# EAGLE design sequenceGameRev1-0 (EAGLE 9.6.2)
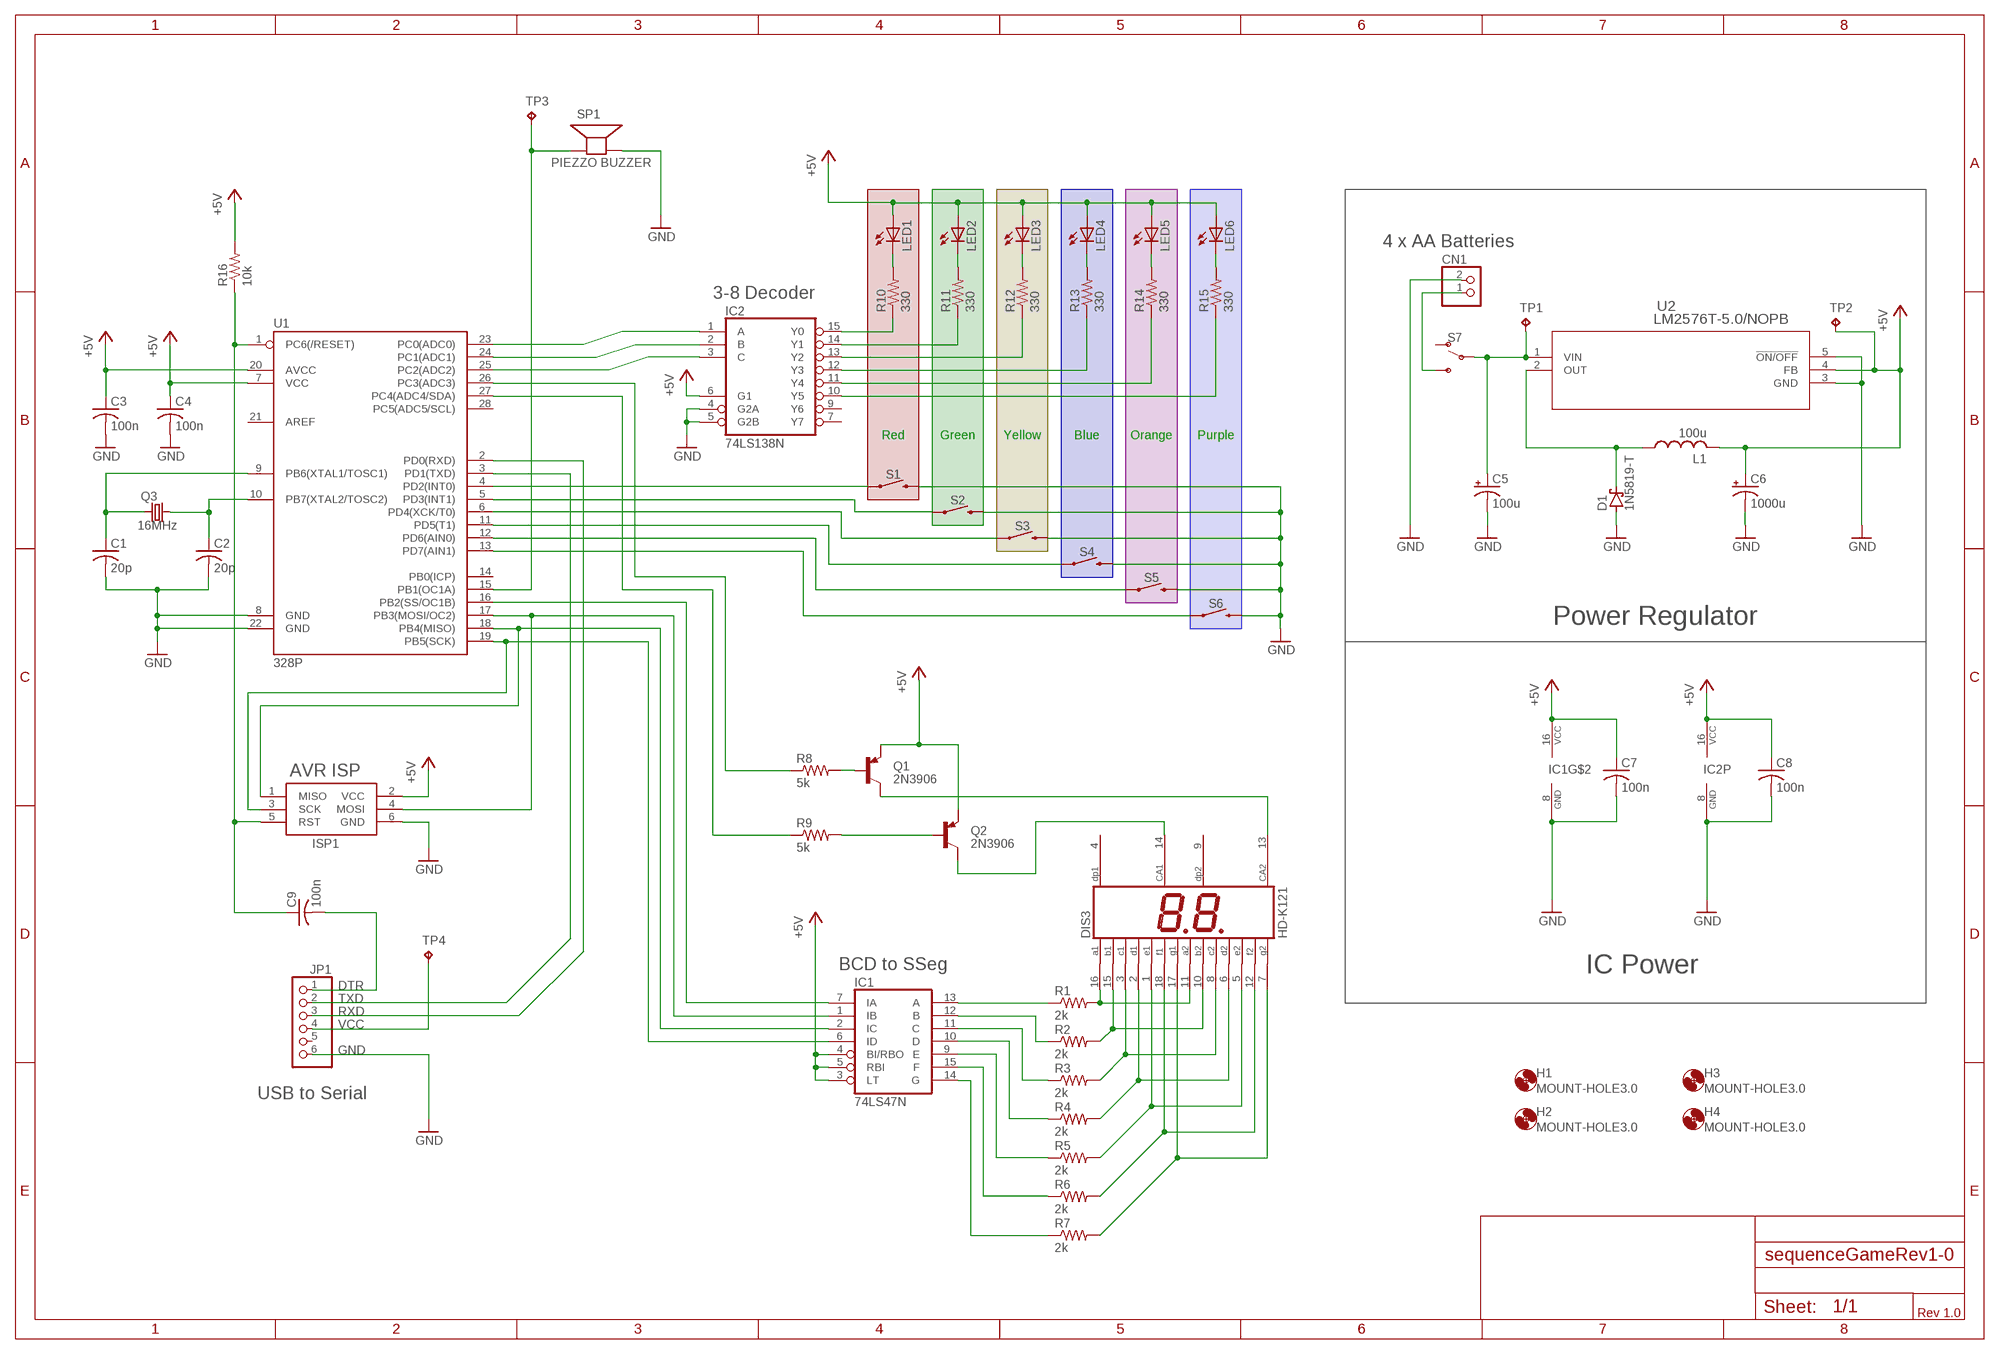
[diagram p0: schematic, sheet 1]

## Parts
C1  20p  C-US050-025X075  [C050-025X075]
C2  20p  C-US050-025X075  [C050-025X075]
C3  100n  C-US050-025X075  [C050-025X075]
C4  100n  C-US050-025X075  [C050-025X075]
C5  100u  CPOL-USE2.5-5  [E2,5-5]
C6  1000u  CPOL-USE5-10.5  [E5-10,5]
C7  100n  C-US050-025X075  [C050-025X075]
C8  100n  C-US050-025X075  [C050-025X075]
C9  100n  C-US050-025X075  [C050-025X075]
CN1  JST_2PIN-THM  [JST-PH-2-THM]
D1  1N5819-T  [DO41-7.6]
DIS3  HD-K121  [HDSP-R]
H1  MOUNT-HOLE3.0  [3,0]
H2  MOUNT-HOLE3.0  [3,0]
H3  MOUNT-HOLE3.0  [3,0]
H4  MOUNT-HOLE3.0  [3,0]
IC1  74LS47N  [DIL16]
IC2  74LS138N  [DIL16]
ISP1  AVRISP-6  [AVRISP]
JP1  PINHD-1X6  [1X06]
L1  100u  L-US0207/10  [0207/10]
LED1  LED5MM  [LED5MM]
LED2  LED5MM  [LED5MM]
LED3  LED5MM  [LED5MM]
LED4  LED5MM  [LED5MM]
LED5  LED5MM  [LED5MM]
LED6  LED5MM  [LED5MM]
Q1  2N3906  [TO92]
Q2  2N3906  [TO92]
Q3  16MHz  CRYSTALHC49S  [HC49/S]
R1  2k  R-US_0207/10  [0207/10]
R2  2k  R-US_0207/10  [0207/10]
R3  2k  R-US_0207/10  [0207/10]
R4  2k  R-US_0207/10  [0207/10]
R5  2k  R-US_0207/10  [0207/10]
R6  2k  R-US_0207/10  [0207/10]
R7  2k  R-US_0207/10  [0207/10]
R8  5k  R-US_0207/10  [0207/10]
R9  5k  R-US_0207/10  [0207/10]
R10  330  R-US_0207/10  [0207/10]
R11  330  R-US_0207/10  [0207/10]
R12  330  R-US_0207/10  [0207/10]
R13  330  R-US_0207/10  [0207/10]
R14  330  R-US_0207/10  [0207/10]
R15  330  R-US_0207/10  [0207/10]
R16  10k  R-US_0207/10  [0207/10]
S1  MOMENTARY-SWITCH-SPST-PTH-6.0MM  [TACTILE_SWITCH_PTH_6.0MM]
S2  MOMENTARY-SWITCH-SPST-PTH-6.0MM  [TACTILE_SWITCH_PTH_6.0MM]
S3  MOMENTARY-SWITCH-SPST-PTH-6.0MM  [TACTILE_SWITCH_PTH_6.0MM]
S4  MOMENTARY-SWITCH-SPST-PTH-6.0MM  [TACTILE_SWITCH_PTH_6.0MM]
S5  MOMENTARY-SWITCH-SPST-PTH-6.0MM  [TACTILE_SWITCH_PTH_6.0MM]
S6  MOMENTARY-SWITCH-SPST-PTH-6.0MM  [TACTILE_SWITCH_PTH_6.0MM]
S7  SWITCH-SPDT-PTH-11.6X4.0MM  [SWITCH_SPDT_PTH_11.6X4.0MM]
SP1  PIEZZO BUZZER  SPEAKER/AL60P  [AL60P]
TP1  TPB1,27  [B1,27]
TP2  TPB1,27  [B1,27]
TP3  TPB1,27  [B1,27]
TP4  TPB1,27  [B1,27]
U1  328P  ATMEGA328P_PDIP  [DIP28]
U2  LM2576T-5.0/NOPB  [T05A_TEX]

## Nets
+5V [POWER]: C3.1 C4.1 C6.+ C7.1 C8.1 IC1.3(LT) IC1.4(BI/RBO) IC1.5(RBI) IC1.16(VCC) IC2.6(G1) IC2.16(VCC) ISP1.2(VCC) L1.2 LED1.A LED2.A LED3.A LED4.A LED5.A LED6.A Q1.3(E) Q2.3(E) R16.2 TP2.TP U1.7(VCC) U1.20(AVCC) U2.4(FB)
BATT_IN [POWER]: CN1.1 S7.3(S)
DTR: C9.2 JP1.1
GND [GND]: C1.2 C2.2 C3.2 C4.2 C5.- C6.- C7.2 C8.2 CN1.2 D1.A IC1.8(GND) IC2.4(G2A) IC2.5(G2B) IC2.8(GND) ISP1.6(GND) JP1.6 S1.3 S2.3 S3.3 S4.3 S5.3 S6.3 SP1.2(-) U1.8(GND) U1.22(GND) U2.3(GND) U2.5(!ON/OFF)
LDO_IN [POWER]: C5.+ S7.2(P) TP1.TP U2.1(VIN)
LDO_OUT [POWER]: D1.C L1.1 U2.2(OUT)
N$1: DIS3.10(B2) DIS3.15(B1) R2.2
N$2: SP1.1(+) TP3.TP U1.15(PB1(OC1A))
N$3: DIS3.3(C1) DIS3.8(C2) R3.2
N$4: DIS3.2(D1) DIS3.6(D2) R4.2
N$5: DIS3.1(E1) DIS3.5(E2) R5.2
N$6: DIS3.12(F2) DIS3.18(F1) R6.2
N$7: IC1.13(A) R1.1
N$8: IC1.12(B) R2.1
N$9: IC1.11(C) R3.1
N$10: IC1.10(D) R4.1
N$11: IC1.9(E) R5.1
N$12: Q2.2(B) R9.2
N$13: R8.1 U1.26(PC3(ADC3))
N$14: Q1.2(B) R8.2
N$15: DIS3.7(G2) DIS3.17(G1) R7.2
N$16: C2.1 Q3.1 U1.10(PB7(XTAL2/TOSC2))
N$17: IC2.15(Y0) R10.1
N$18: IC2.14(Y1) R11.1
N$19: IC2.13(Y2) R12.1
N$20: IC2.12(Y3) R13.1
N$21: IC2.11(Y4) R14.1
N$22: IC2.10(Y5) R15.1
N$23: C1.1 Q3.2 U1.9(PB6(XTAL1/TOSC1))
N$24: LED1.K(C) R10.2
N$25: LED2.K(C) R11.2
N$26: LED3.K(C) R12.2
N$27: LED4.K(C) R13.2
N$28: LED5.K(C) R14.2
N$29: LED6.K(C) R15.2
N$30: IC1.15(F) R6.1
N$31: S4.1 U1.11(PD5(T1))
N$32: S5.1 U1.12(PD6(AIN0))
N$33: IC1.6(ID) ISP1.3(SCK) U1.19(PB5(SCK))
N$35: S6.1 U1.13(PD7(AIN1))
N$37: IC1.2(IC) ISP1.1(MISO) U1.18(PB4(MISO))
N$38: S2.1 U1.5(PD3(INT1))
N$39: IC2.1(A) U1.23(PC0(ADC0))
N$40: IC2.2(B) U1.24(PC1(ADC1))
N$41: S3.1 U1.6(PD4(XCK/T0))
N$42: IC1.7(IA) U1.16(PB2(SS/OC1B))
N$43: IC1.1(IB) ISP1.4(MOSI) U1.17(PB3(MOSI/OC2))
N$44: R9.1 U1.27(PC4(ADC4/SDA))
N$45: DIS3.13(CA2) Q1.1(C)
N$46: IC2.3(C) U1.25(PC2(ADC2))
N$47: DIS3.14(CA1) Q2.1(C)
N$48: DIS3.11(A2) DIS3.16(A1) R1.2
N$51: IC1.14(G) R7.1
N$52: S1.1 U1.4(PD2(INT0))
RESET: C9.1 ISP1.5(RST) R16.1 U1.1(PC6(/RESET))
RXD: JP1.3 U1.2(PD0(RXD))
TXD: JP1.2 U1.3(PD1(TXD))
VCC: JP1.4 TP4.TP
Unconnected: DIS3.4(DP1) DIS3.9(DP2) IC2.7(Y7) IC2.9(Y6) JP1.5 S7.1(O) U1.14(PB0(ICP)) U1.21(AREF) U1.28(PC5(ADC5/SCL))

## Notes on the sheet
- 4 x AA Batteries
- 3-8 Decoder
- Red | Green | Yellow | Blue | Orange | Purple
- Power Regulator
- AVR ISP
- BCD to SSeg | IC Power
- USB to Serial
- Rev 1.0

## Library data of the parts
C1-C4 C7-C9 = adafruit:C-US: CAPACITOR, American symbol
C5 C6 = adafruit:CPOL-US: POLARIZED CAPACITOR, American symbol
CN1 = adafruit:JST_2PIN: JST 2-Pin Connectors of various flavors SMT-RA (S2B-PH-SM4) 4UConnector #17311 SMT (B2B-PH-SM4) THM-RA (S2B-PH) THM (B2B-PH)
D1 = diode:1N581*: 1.0A SCHOTTKY BARRIER RECTIFIER Source: http://www.diodes.com/datasheets/ds23001.pdf
DIS3 = display-hp:HD-K121: LED DISPLAY 2 x 1 character 7 segment, decimal points right; OC_FARNELL: unknown; OC_NEWARK: unknown
H1-H4 = holes:MOUNT-HOLE: MOUNTING HOLE with drill center marker
IC1 = 74xx-us:74*47: BCD to seven segment DECODER/DRIVER Source: http://www.ee.washington.edu/stores/DataSheets/74ls/74ls47.pdf
IC2 = 74xx-us:74*138: 3-line to 8-line DECODER/DEMULTIPLEXER
ISP1 = adafruit:AVRISP: AVR ISP HEADER Standard 6 pin header for AVR programming
JP1 = adafruit:PINHD-1X6: PIN HEADER
L1 = rcl:L-US: INDUCTOR, American symbol; SPICEPREFIX: L
LED1-LED6 = adafruit:LED: LED OSRAM: - CHIPLED LG R971, LG N971, LY N971, LG Q971, LY Q971, LO R971, LY R971 LH N974, LH R974 LS Q976, LO Q976, LY Q976 LO Q996 - Hyper CHIPLED LW Q18S LB Q993, LB Q99A, LB R99A - SideLED LS A670, LO A670, LY A670, LG A670, LP A670 LB A673, LV A673, LT A673, LW A673 LH A674 LY A675 LS A676, LA A676, LO A676, LY A676, LW A676 LS A679, LY A679, LG A679 - Hyper Micro SIDELED® LS Y876, LA Y876, LO Y876, LY Y876 LT Y87S - SmartLED LW L88C, LW L88S LB L89C, LB L89S, LG L890 LS L89K, LO L89K, LY L89K LS L896, LA L896, LO L896, LY L896 - TOPLED LS T670, LO T670, LY T670, LG T670, LP T670 LSG T670, LSP T670, LSY T670, LOP T670, LYG T670 LG T671, LOG T671, LSG T671 LB T673, LV T673, LT T673, LW T673 LH T674 LS T676, LA T676, LO T676, LY T676, LB T676, LH T676, LSB T676, LW T676 LB T67C, LV T67C, LT T67C, LS T67K, LO T67K, LY T67K, LW E67C LS E67B, LA E67B, LO E67B, LY E67B, LB E67C, LV E67C, LT E67C LW T67C LS T679, LY T679, LG T679 LS T770, LO T770, LY T770, LG T770, LP T770 LB T773, LV T773, LT T773, LW T773 LH T774 LS E675, LA E675, LY E675, LS T675 LS T776, LA T776, LO T776, LY T776, LB T776 LHGB T686 LT T68C, LB T68C - Hyper Mini TOPLED® LB M676 - Mini TOPLED Santana® LG M470 LS M47K, LO M47K, LY M47K Source: http://www.osram.convergy.de/
Q1 Q2 = transistor-pnp:2N3906: PNP Transistor
Q3 = crystal:CRYSTAL: CRYSTAL; OC_FARNELL: 1667008; OC_NEWARK: unknown
R1-R16 = adafruit:R-US_: RESISTOR, American symbol
S1-S6 = SparkFun-Switches:MOMENTARY-SWITCH-SPST: Momentary Switch (Pushbutton) - SPST Normally-open (NO) SPST momentary switches (buttons, pushbuttons). Variants PTH-12MM - 12mm square, through-hole Momentary Pushbutton Switch - 12mm Square <https://www.sparkfun.com/products/9190> (COM-09190) PTH-6.0MM, PTH-6.0MM-KIT - 6.0mm square, through-hole Mini Pushbutton Switch <https://www.sparkfun.com/products/97> (COM-00097) KIT package intended for soldering kit's - only one side of pads' copper is exposed. PTH-RIGHT-ANGLE-KIT - Right-angle, through-hole Right Angle Tactile Button <https://www.sparkfun.com/products/10791> - Used on SparkFun BigTime Watch Kit <https://www.sparkfun.com/products/11734> SMD-12MM - 12mm square, surface-mount Tactile Button - SMD (12mm) <https://www.sparkfun.com/products/12993> (COM-12993) Used on SparkFun PicoBoard <https://www.sparkfun.com/products/11888> SMD-4.5MM - 4.5mm Square Trackball Switch Used on SparkFun Blackberry Trackballer Breakout <https://www.sparkfun.com/products/13169> SMD-4.6MMX2.8MM - 4.60mm x 2.80mm, surface mount Used on SparkFun SAMD21 Mini Breakout <https://www.sparkfun.com/products/13664> SMD-5.2MM, SMD-5.2-REDUNDANT - 5.2mm square, surface-mount Mini Pushbutton Switch - SMD <https://www.sparkfun.com/products/8720> (COM-08720) Used on Arduino Pro Mini <https://www.sparkfun.com/products/11114> REDUNDANT package connects both switch circuits together SMD-6.0X3.5MM - 6.0 x 3.5mm, surface mount Momentary Reset Switch SMD <https://www.sparkfun.com/products/8229> (COM-08229) SMD-6.2MM-TALL - 6.2mm square, surface mount Tactile Button - SMD (6mm) <https://www.sparkfun.com/products/12992> Used on SparkFun Digital Sandbox <https://www.sparkfun.com/products/12651> SMD-RIGHT-ANGLE - Right-angle, surface mount Used on SparkFun Block for Intel® Edison - Arduino <https://www.sparkfun.com/products/13036>; PROD_ID: SWCH-08441; SF_SKU: COM-00097
S7 = SparkFun-Switches:SWITCH-SPDT: Single Pole, Double Throw (SPDT) Switch Single-pole, double-throw (SPDT) switch. Variant Overview SMD-AYZ0202 Surface Mount DPDT Switch <https://www.sparkfun.com/products/597> (COM-00597) Used on e.g. LilyPad Arduino USB - ATmega32U4 Board <https://www.sparkfun.com/products/12049> PTH-11.6X4.0MM SPDT Mini Power Switch <https://www.sparkfun.com/products/102> (COM-00102) Used on e.g. SparkFun Simon Says - Through-Hole Soldering Kit <https://www.sparkfun.com/products/10547> (KIT-10547) PTH-11.6X4.0MM-KIT KIT version of SPDT Mini Power Switch - Simplifies soldering by removing tStop of switch pins - only one side can be soldered. PTH-11.6X4.0MM-LOCK LOCK version of SPDT Mini Power Switch - Offset pins hold switch in place for easier soldering. SMD-RIGHT-ANGLE Surface Mount Right Angle Switch <https://www.sparkfun.com/products/10860> (COM-10860) Used on e.g. SparkFun ESP8266 Thing <https://www.sparkfun.com/products/13231>; PROD_ID: SWCH-08261; SF_SKU: COM-00102
SP1 = adafruit:SPEAKER: SPEAKER Source: Buerklin Added PS12 (for part # PS1240 piezo) http://www.ladyada.net/library/pcb/eaglelibrary.html
TP1-TP4 = testpad:TP: Test pad
U1 = SparkFun-IC-Microcontroller:ATMEGA328P_PDIP: Atmel 328P Through hole ATMEGA328P uC used in the Arduino 32kb flash, 1k EEPROM, 2k SRAM Datasheet <http://www.sparkfun.com/datasheets/Components/SMD/ATMega328.pdf> SparkFun Products Storefront component: AVR 28 Pin 20MHz 32K 6A/D - ATMega328P <https://www.sparkfun.com/products/9061> (COM-09061) SparkFun Simon Says - Through-Hole Soldering Kit <https://www.sparkfun.com/products/10547> (KIT-10547) SparkFun Learn to Solder - Simon Says <https://www.sparkfun.com/products/13708> (KIT-13708) SparkFun BigTime Watch Kit <https://www.sparkfun.com/products/11734> (KIT-11734) SparkFun ClockIt <https://www.sparkfun.com/products/10930> (KIT-10930) SparkFun Serial Enabled LCD Kit <https://www.sparkfun.com/products/10097> (LCD-10097) SparkFun Simon Tilts - Through Hole Soldering Kit <https://www.sparkfun.com/products/12634> (KIT-12634) SparkFun Frequency Counter Kit <https://www.sparkfun.com/products/10140> (KIT-10140) FabFM Radio Kit <https://www.sparkfun.com/products/11043> (KIT-11043) SparkFun Binary Blaster Kit <https://www.sparkfun.com/products/12037> (KIT-12037) SparkFun Metro-Gnome <https://www.sparkfun.com/products/9236> (KIT-09236) ATmega328 with Arduino Optiboot (Uno) <https://www.sparkfun.com/products/10524> (DEV-10524); PROD_ID: IC-09136
U2 = Jons_Parts:LM2576T-5.0/NOPB; BUILT_BY: EMA_UL_Team; COPYRIGHT: Copyright (C) 2018 Accelerated Designs. All rights reserved; MANUFACTURER_PART_NUMBER: LM2576T-5.0/NOPB; SOURCELIBRARY: National_2011-09-26; VENDOR: Texas Instruments

## Net classes
0 default: width 0.5 mm, clearance 0.2 mm
1 POWER: width 1 mm, clearance 0.2 mm
2 GND: width 1 mm, clearance 0.2 mm

## Board
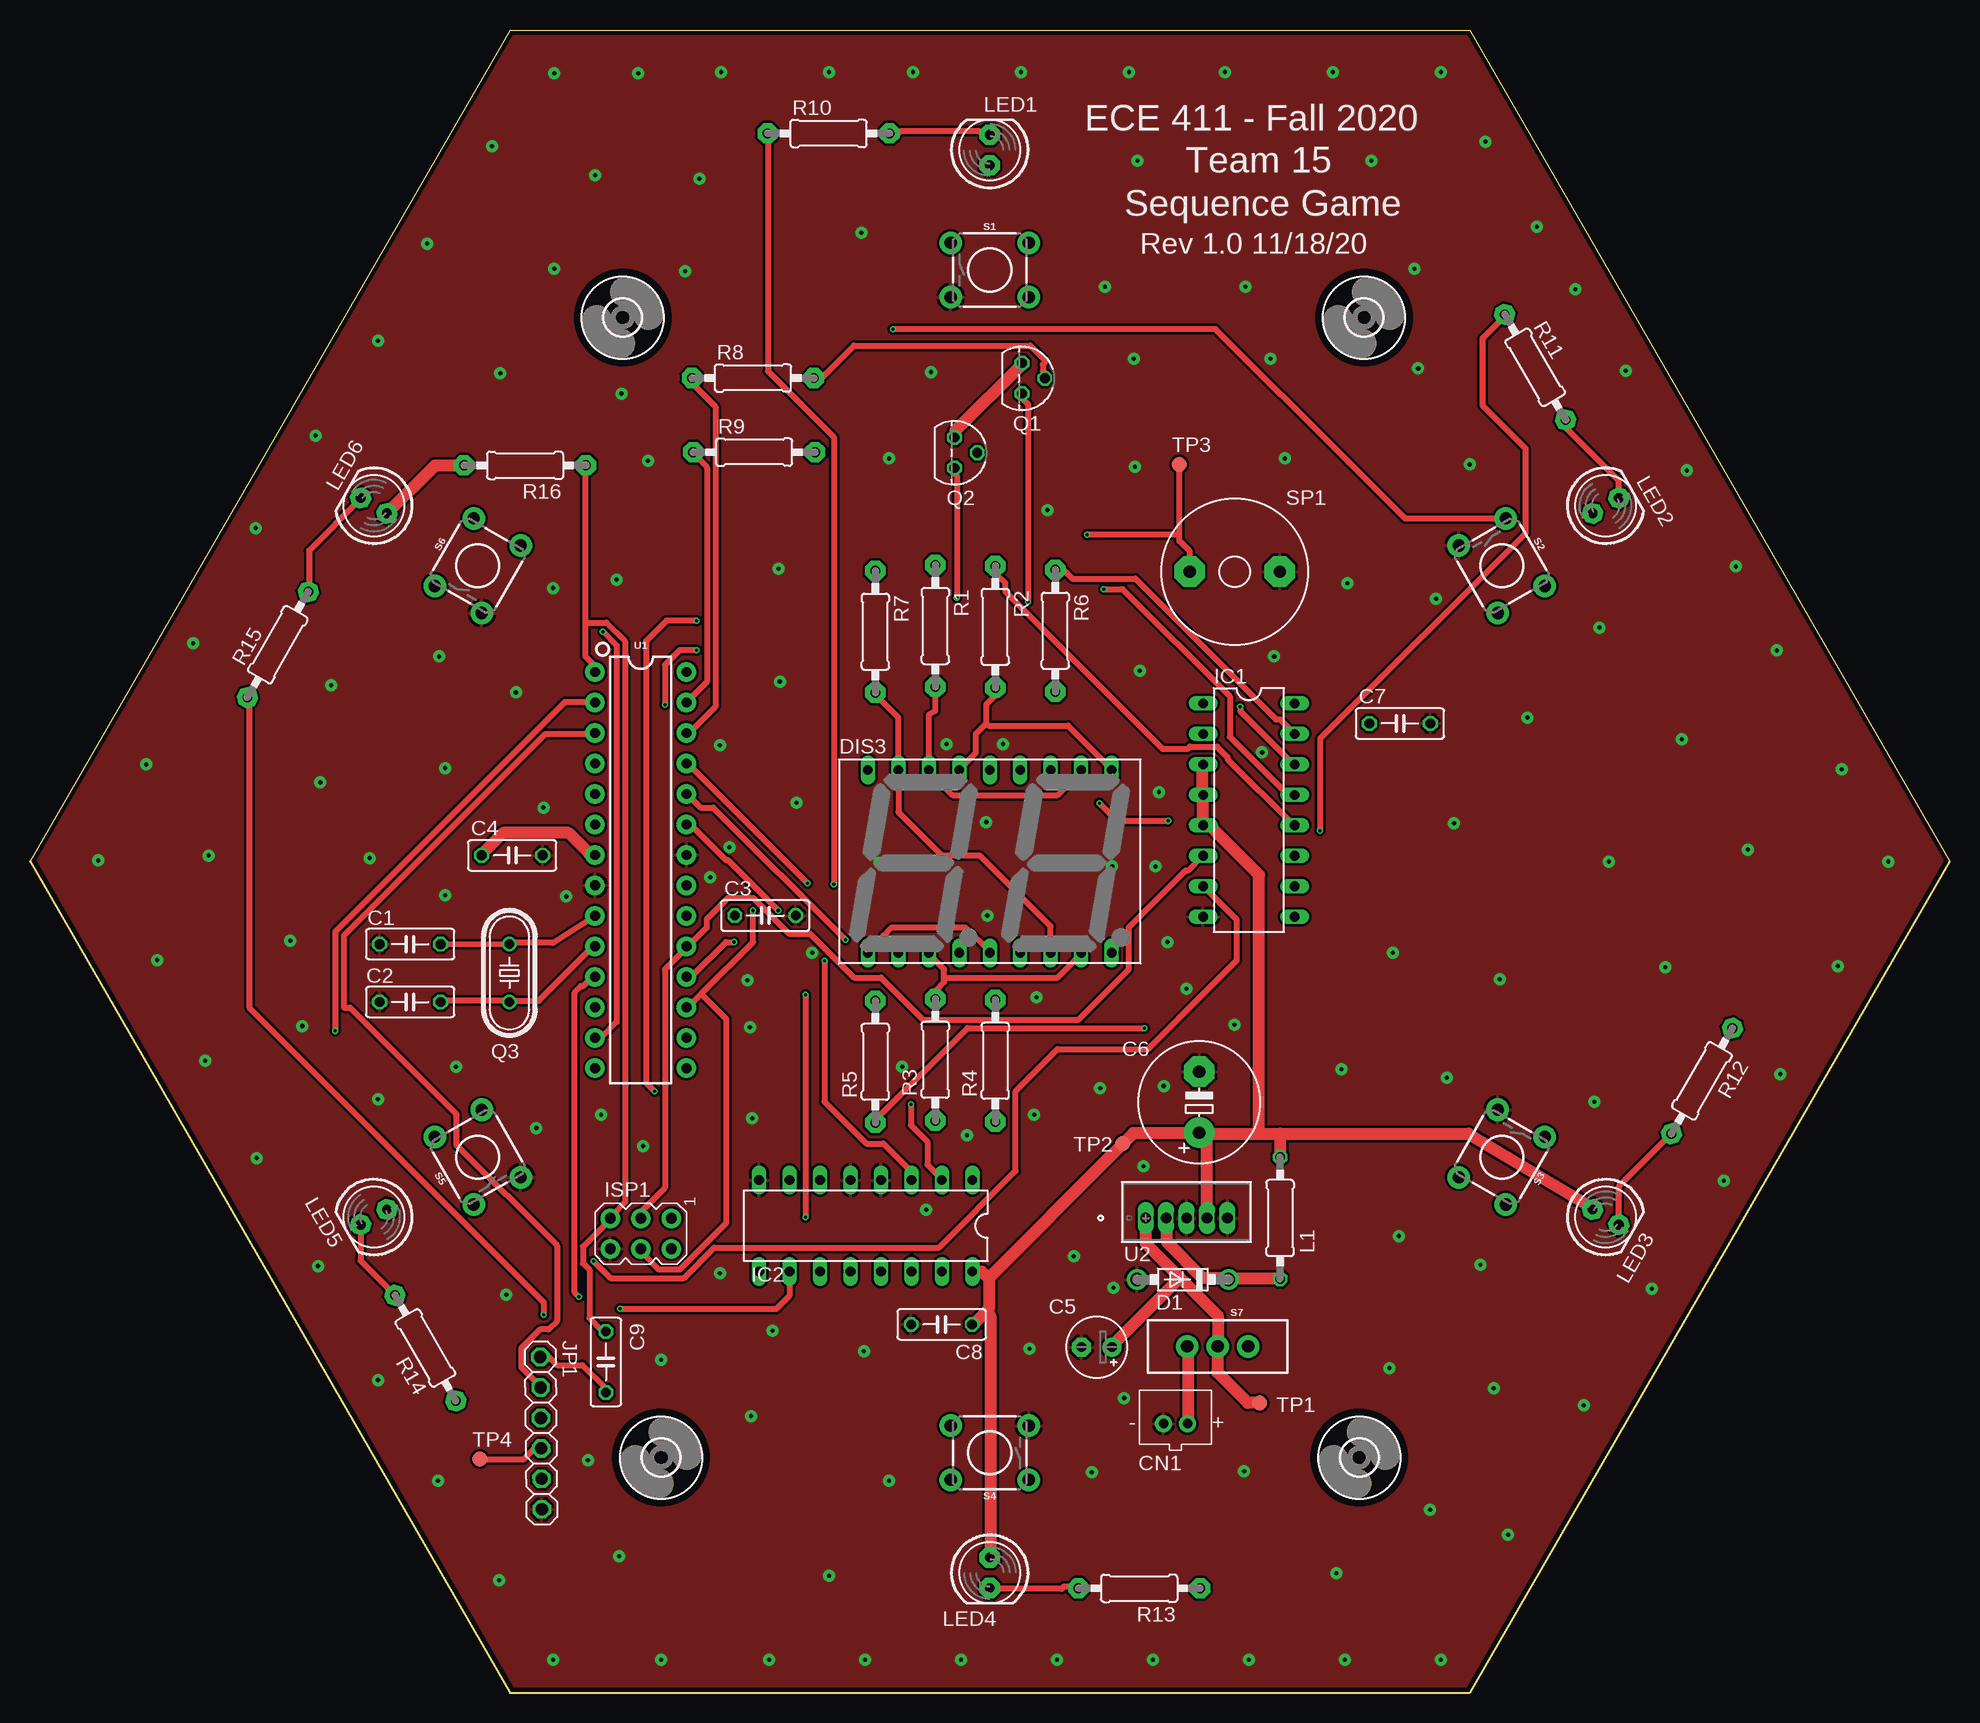
[diagram p1: board, top side]
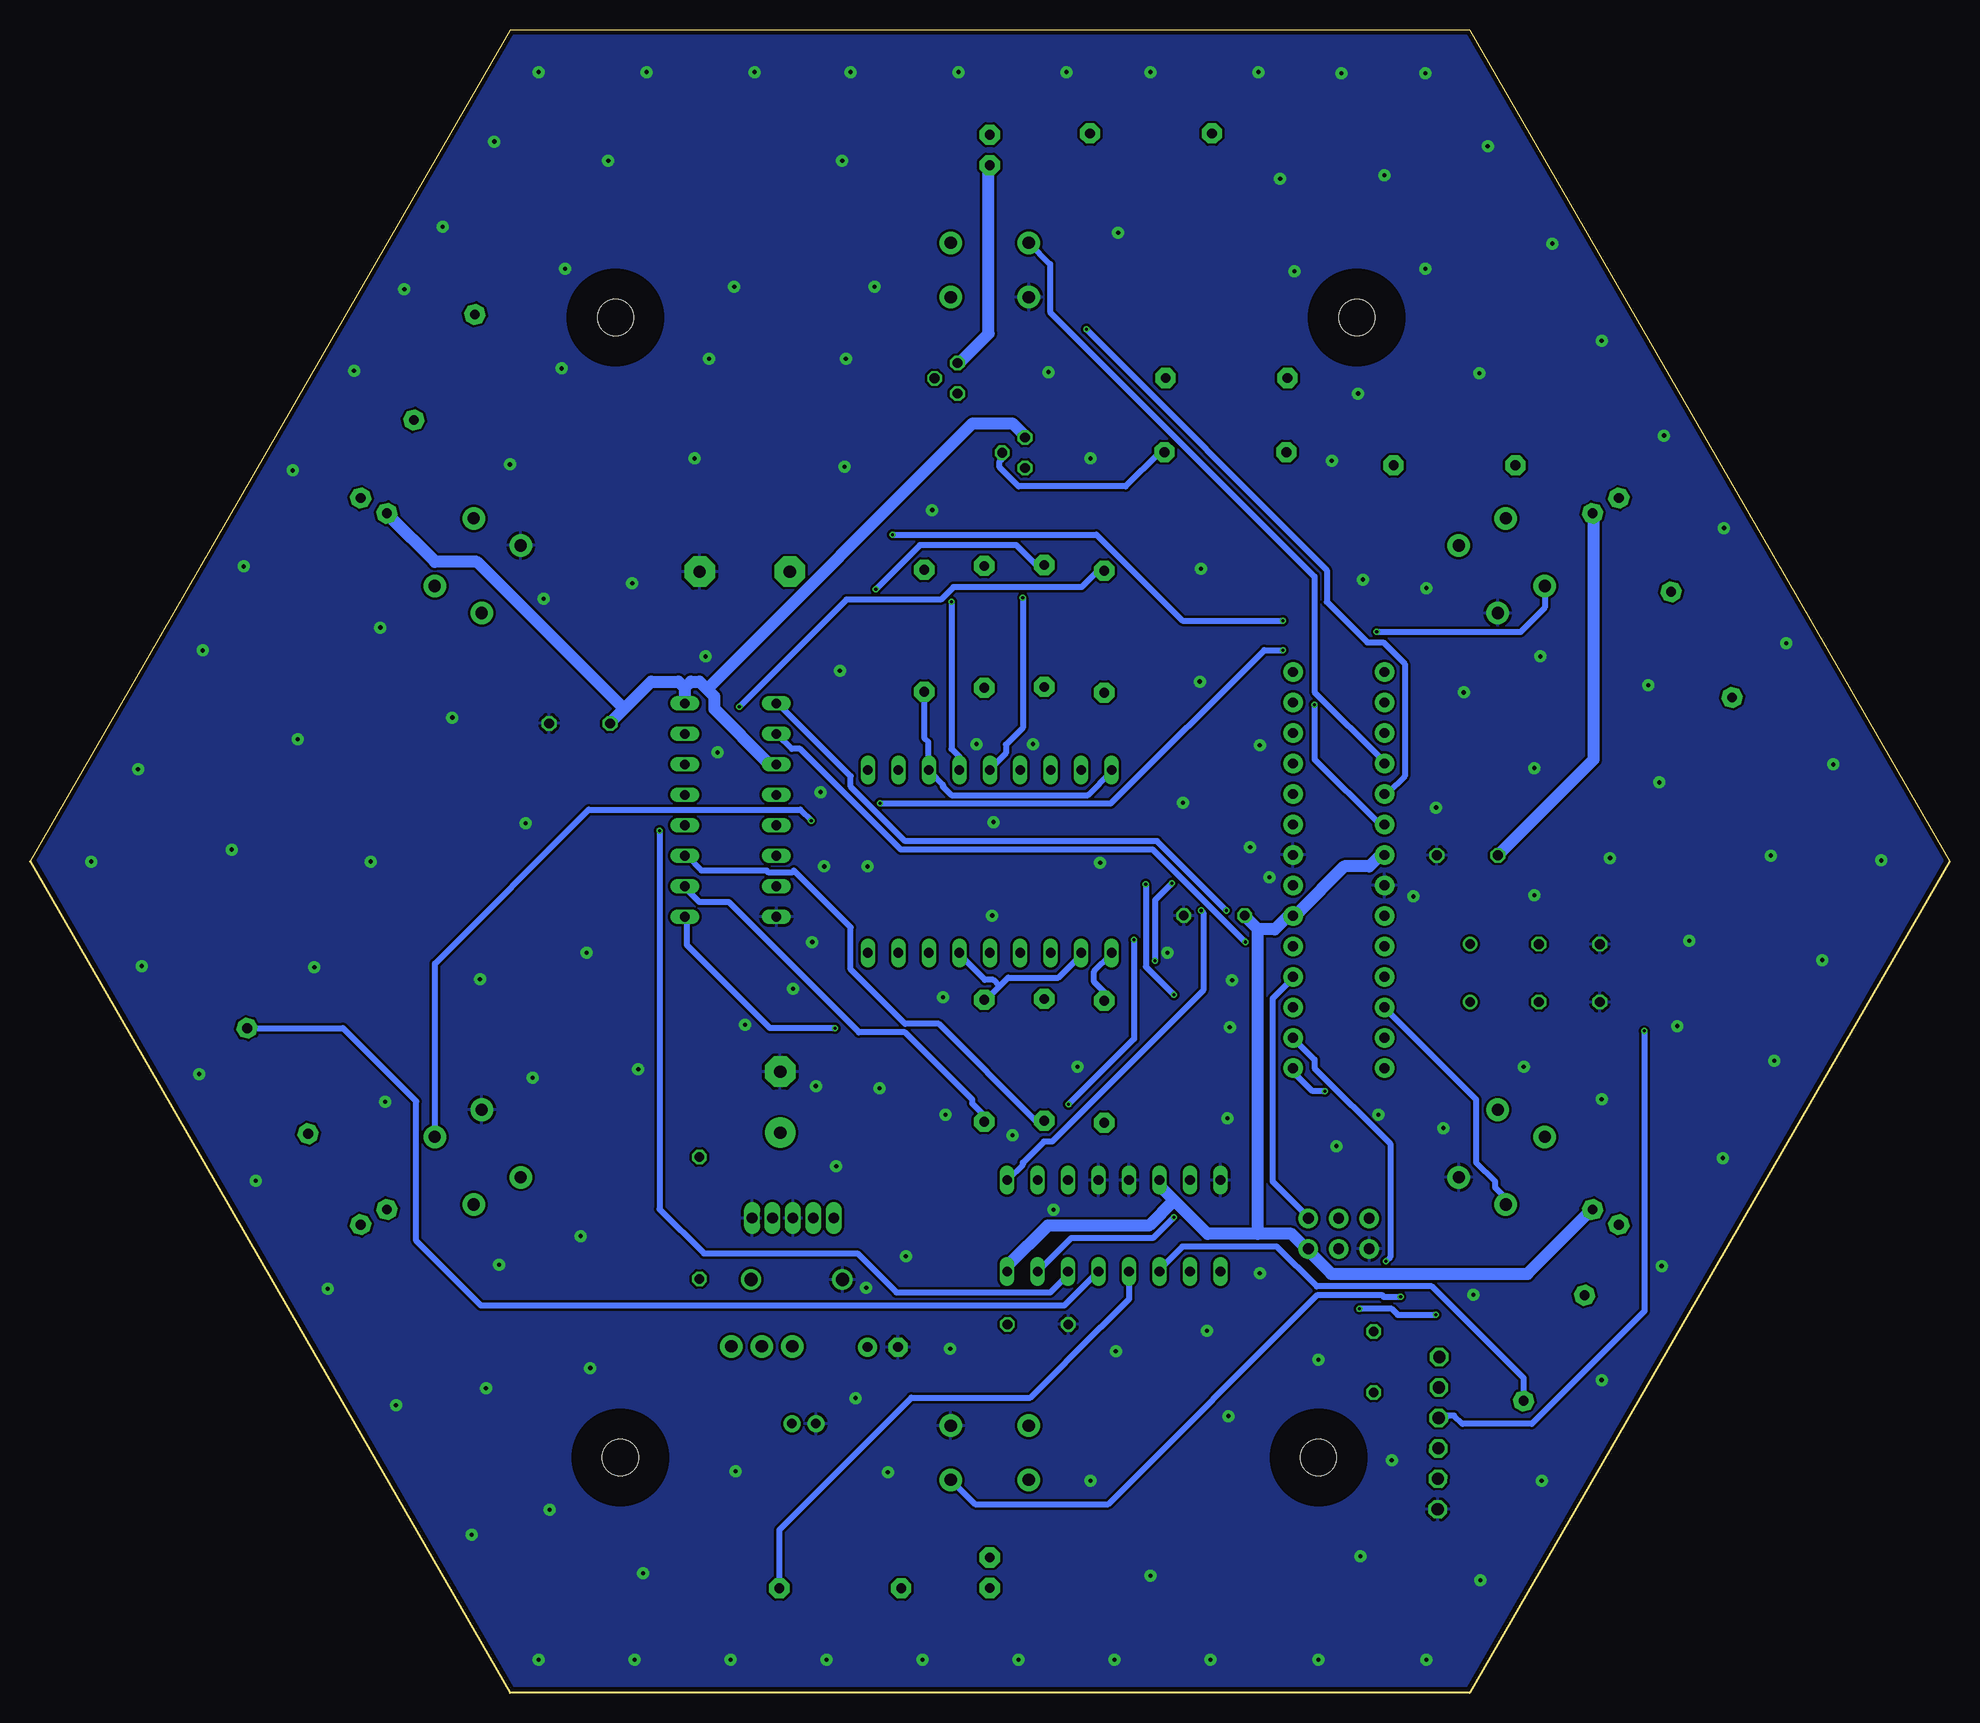
[diagram p2: board, bottom side, seen from below]

Size 160 x 138.56 mm. Coordinates in mm from the lower left corner, seen from the top.
Outline: 40,138.56 120,138.56 160,69.28 120,0 40,0 0,69.28 40,138.56
Copper layers (1*16): Top 0.035559375mm / dielectric 1.6mm / Bottom 0.035559375mm
Design rules "oshpark-2layer": minimum track width 6mil, minimum drill 10mil, track to track 6mil, track to pad 6mil, pad to pad 6mil, via to via 6mil, smd to smd 6mil, copper to edge 15mil, drill to drill 6mil, minimum pad ring 5mil, minimum via ring 5mil, stop-mask expansion 2.5mil, vias tented up to drill 0mil, thermal gap 10mil

### Footprints (pad centres in the part's own frame; a part is rotated, then mirrored left to right if it is on the bottom)
C050-025X075 = drill 0.813 octagon: 1 -2.54,0; 2 2.54,0
E2,5-5 = drill 0.813 pad 1.6: + -1.27,0 | drill 0.813 pad 1.6 octagon: - 1.27,0
E5-10,5 = drill 1.016 pad 2.54: + -2.54,0 | drill 1.016 pad 2.54 octagon: - 2.54,0
JST-PH-2-THM = drill 0.8 pad 1.422: 1 1,0; 2 -1,0
DO41-7.6 = drill 1.1 pad 1.7: A 3.81,0; C -3.81,0
HDSP-R = drill 0.813 long: 1 -10.16,-7.62; 2 -7.62,-7.62; 3 -5.08,-7.62; 4 -2.54,-7.62; 5 0,-7.62; 6 2.54,-7.62; 7 5.08,-7.62; 8 7.62,-7.62; 9 10.16,-7.62; 10 10.16,7.62; 11 7.62,7.62; 12 5.08,7.62; 13 2.54,7.62; 14 0,7.62; 15 -2.54,7.62; 16 -5.08,7.62; 17 -7.62,7.62; 18 -10.16,7.62
3,0 = hole 3: 0,0
DIL16 = drill 0.813 long: 1 -8.89,-3.81; 2 -6.35,-3.81; 3 -3.81,-3.81; 4 -1.27,-3.81; 5 1.27,-3.81; 6 3.81,-3.81; 7 6.35,-3.81; 8 8.89,-3.81; 9 8.89,3.81; 10 6.35,3.81; 11 3.81,3.81; 12 1.27,3.81; 13 -1.27,3.81; 14 -3.81,3.81; 15 -6.35,3.81; 16 -8.89,3.81
AVRISP = drill 0.9 pad 1.626: 1 -1.27,2.54; 2 1.27,2.54; 3 -1.27,0; 4 1.27,0; 5 -1.27,-2.54; 6 1.27,-2.54
1X06 = drill 1.016 octagon: 1 -6.35,0; 2 -3.81,0; 3 -1.27,0; 4 1.27,0; 5 3.81,0; 6 6.35,0
0207/10 = drill 0.813 octagon: 1 -5.08,0; 2 5.08,0
LED5MM = drill 0.813 pad 1.676 octagon: A -1.27,0; K 1.27,0
TO92 = drill 0.813 octagon: 1 1.27,0; 2 0,1.905; 3 -1.27,0
HC49/S = drill 0.813: 1 -2.413,0; 2 2.413,0
0207/10' = drill 0.813 pad 1.676 octagon: 1 -5.08,0; 2 5.08,0
TACTILE_SWITCH_PTH_6.0MM = drill 1.016 pad 1.88: 1 -3.251,2.261; 2 3.251,2.261; 3 -3.251,-2.261; 4 3.251,-2.261
SWITCH_SPDT_PTH_11.6X4.0MM = drill 1.016 pad 1.88: 1 0,2.54; 2 0,0; 3 0,-2.54
AL60P = drill 1.016 pad 2.54 octagon: 1 -3.759,0; 2 3.759,0
B1,27 = smd 1.27 x 1.27: TP 0,0
DIP28 = drill 0.813 pad 1.626: 1 -16.51,-3.81; 2 -13.97,-3.81; 3 -11.43,-3.81; 4 -8.89,-3.81; 5 -6.35,-3.81; 6 -3.81,-3.81; 7 -1.27,-3.81; 8 1.27,-3.81; 9 3.81,-3.81; 10 6.35,-3.81; 11 8.89,-3.81; 12 11.43,-3.81; 13 13.97,-3.81; 14 16.51,-3.81; 15 16.51,3.81; 16 13.97,3.81; 17 11.43,3.81; 18 8.89,3.81; 19 6.35,3.81; 20 3.81,3.81; 21 1.27,3.81; 22 -1.27,3.81; 23 -3.81,3.81; 24 -6.35,3.81; 25 -8.89,3.81; 26 -11.43,3.81; 27 -13.97,3.81; 28 -16.51,3.81
T05A_TEX = drill 0.889 pad 1.016 long: 1 0,0; 2 1.702,0; 3 3.404,0; 4 5.105,0; 5 6.807,0

### Placement (x,y rotation side)
C1  31.69,62.38 180 top
C2  31.69,57.56 180 top
C3  61.29,64.76 0 top
C4  40.19,69.78 0 top
C5  88.92,28.8 180 top
C6  97.46,49.21 90 top
C7  114.19,80.77 0 top
C8  75.99,30.69 180 top
C9  48,27.56 270 top
CN1  95.49,22.42 0 top
D1  96.09,34.43 180 top
DIS3  80,69.28 0 top
H1  110.8,19.6 0 top
H2  52.6,19.6 0 top
H3  49.4,114.6 0 top
H4  111.2,114.6 0 top
IC1  101.6,73.55 270 top
IC2  69.66,38.91 180 top
ISP1  50.91,38.26 270 top
JP1  42.6,21.63 270.6 top
L1  104.2,39.56 90 top
LED1  80,128.56 90 top
LED2  131.34,98.92 30 top
LED3  131.34,39.64 330 top
LED4  80,10 270 top
LED5  28.66,39.64 210 top
LED6  28.66,98.92 150 top
Q1  82.69,109.53 270 top
Q2  77.06,103.33 270 top
Q3  39.96,59.98 90 top
R1  2k  [0207/10']  75.46,88.9 270 top
R2  2k  [0207/10']  80.46,88.82 270 top
R3  2k  [0207/10']  75.46,52.74 90 top
R4  2k  [0207/10']  80.46,52.66 90 top
R5  2k  [0207/10']  70.46,52.58 90 top
R6  2k  [0207/10']  85.46,88.5 270 top
R7  2k  [0207/10']  70.46,88.42 270 top
R8  5k  [0207/10']  60.26,109.56 0 top
R9  5k  [0207/10']  60.36,103.38 0 top
R10  330  [0207/10']  66.56,129.94 0 top
R11  330  [0207/10']  125.46,110.46 300 top
R12  330  [0207/10']  139.36,50.98 240 top
R13  330  [0207/10']  92.46,8.7 180 top
R14  330  [0207/10']  32.96,28.72 120 top
R15  330  [0207/10']  20.66,87.34 60 top
R16  10k  [0207/10']  41.26,102.28 180 top
S1  80,118.56 0 top
S2  122.68,93.92 300 top
S3  122.68,44.64 240 top
S4  80,20 180 top
S5  37.32,44.64 120 top
S6  37.32,93.92 60 top
S7  99,28.86 270 top
SP1  100.42,93.42 0 top
TP1  102.5,24.16 0 top
TP2  91.1,45.76 0 top
TP3  95.8,102.36 0 top
TP4  37.5,19.46 0 top
U1  50.91,68.55 270 top
U2  93,39.56 0 top

### Tracks (layer width: path | path; a pad name or v marks a point on that pad's centre or on a via)
+5V
  Top 1: Q2.3 77.12,105.13 82.67,110.69 Q1.3 | IC1.3 97.72,77.26 97.72,75.16 IC1.4 97.72,74.81 97.72,72.36 IC1.5 98.25,72.19 98.42,72.19 102.45,68.16 102.45,46.59 | 79.7,31.76 79.92,31.99 79.92,34.51 79.87,34.56 | 79.7,31.76 78.65,30.71 C8.1 | 79.87,34.56 79.35,35.09 78.65,35.09 IC2.16 | 79.7,31.76 80.05,31.41 80.05,11.29 LED4.A | C6.+ 97.37,46.64 91.97,46.64 TP2.TP 90.21,44.88 90.2,44.89 79.87,34.56 | 102.45,46.59 98.3,46.59 98.25,46.64 97.9,46.64 C6.+ | 102.45,46.59 104.2,46.59 | 104.2,46.59 119.9,46.59 130.1,40.51 130.1,40.34 LED3.A | R16.2 36.16,102.26 33.75,102.26 29.82,98.34 29.82,98.26 LED6.A | C4.1 37.7,69.91 39.45,71.66 44.87,71.66 46.62,69.91 46.97,69.91 U1.7 | 104.2,46.59 L1.2 | U2.4 98.07,39.64 98.07,46.11 C6.+
  Bottom 1: LED1.A 80.05,127.14 80.05,126.79 80.1,126.74 80.1,113.26 82.67,110.69 Q1.3 | 105.42,83.74 105.42,82.51 IC1.16 | 105.42,83.74 105.95,84.26 108.22,84.26 110.5,81.99 | 110.5,81.99 111.55,80.94 C7.1 | 110.5,81.99 122.75,94.24 126.25,94.24 130.1,98.09 130.1,98.26 LED2.A | 103.57,83.64 104.2,84.26 104.9,84.26 105.42,83.74 | 103.57,83.64 102.97,83.04 102.97,81.99 98.42,77.44 97.9,77.44 IC1.3 | 103.57,83.64 81.42,105.79 78.12,105.79 77.07,104.74 Q2.3 | 57.65,63.61 58.7,64.66 C3.1 | 57.65,63.61 56.25,63.61 55.2,64.66 54.85,64.66 U1.20 54.32,65.01 50.47,68.86 48.37,68.86 47.5,69.74 47.15,69.74 U1.7 | 64.65,41.04 61.85,38.24 57.65,38.24 | 64.65,41.04 65.87,42.26 65.87,42.61 IC2.6 | 57.65,38.24 54.85,38.24 53.45,36.84 ISP1.2 53.1,36.49 51.52,34.91 35.17,34.91 29.81,40.28 LED5.A | 57.65,38.24 57.65,63.61 | C4.1 37.52,69.91 29.65,77.79 29.65,98.26 29.82,98.26 LED6.A | 64.65,41.04 66.75,38.94 75.15,38.94 78.47,35.61 78.47,35.26 IC2.16
BATT_IN
  Top 1: CN1.1 96.5,22.49 96.5,28.79 96.42,28.87 S7.3
DTR
  Top 0.5: JP1.1 42.7,28 42.87,28.17 43.05,28.17 43.92,27.3 46.02,27.3 48,25.32 C9.2
GND  (via drill 0.35 pad 1)
  other vias: 14.9,69.76 5.7,69.36 9.7,77.36 10.6,61.06 14.6,52.66 18.9,44.56 24,35.56 29,26.06 34,17.66 39.1,9.36 123.2,13.16 129.5,23.96 135.2,33.66 141.2,42.66 145.9,51.56 150.7,60.56 154.9,69.26 151,76.96 145.6,86.86 142.2,93.86 138.1,101.86 133,110.16 128.8,116.96 125.6,122.16 121.3,129.26 57.6,135.06 43.7,134.96 38.5,128.86 33.1,120.76 29,112.66 23.8,104.76 18.8,97.06 13.6,87.46 115.4,118.66 89.6,117.16 69.3,121.66 49.3,108.26 47.1,126.46 143.2,70.26 137.7,79.46 130.8,88.76 120,102.36 115.7,110.36 103.4,111.16 92,111.16 75.1,110.06 43.7,118.66 39.2,109.96 34.1,86.36 24.2,75.86 116.7,15.26 122,25.36 120.9,35.66 130.4,49.26 136.3,60.46 131.6,69.26 122.5,59.46 114.1,38.06 113.3,27.06 101.2,18.46 88.5,18.36 71.6,17.66 60.1,23.06 94.8,62.56 94.1,75.06 57.5,78.96 65.2,61.66 70.8,69.16 90.2,68.86 109.8,92.46 104.6,102.86 92.1,102.16 71.6,102.86 51.5,102.66 60.2,47.86 60,55.46 58.3,70.46 42.8,73.76 62.5,84.26 62.4,93.66 48.9,92.76 43.6,92.06 40.5,83.36 34.6,77.06 28.3,69.56 21.7,62.66 22.7,55.56 29,49.46 39.7,33.16 51.1,45.56 100.4,55.66 109.3,51.96 113.6,61.66 118.7,72.46 124.8,81.26 117.2,91.16 118.1,51.26 83.3,28.66 42.2,47.06 61.9,30.16 83.9,57.96 76.4,79.06 84.8,98.56 46.5,19.36 66.6,9.76 49.1,11.36 108.9,9.96 59.8,59.36 47.6,48.16 83.7,48.16 78.1,46.46 72.7,52.16 74.7,40.26 81.1,79.06 25.1,83.96 69.5,28.46 57.5,34.96 96.4,58.66 102.7,78.36 55.8,126.16 79.8,64.76 79.7,72.56 94.5,50.56 91.2,24.56 90.3,33.76 92.8,43.86 89.2,50.36 44.7,66.36 56.7,67.96 63.9,74.16 87,36.36 92.5,85.16 34.6,66.46 35.5,52.16 93.8,68.86 50.7,134.96 66.6,135.06 73.6,135.06 82.6,135.06 91.6,135.06 99.6,135.06 108.6,135.06 117.6,135.06 117.6,2.76 109.6,2.76 101.6,2.76 93.6,2.76 85.6,2.76 77.6,2.76 69.6,2.76 61.6,2.76 52.6,27.76 52.6,2.76 43.6,2.76 54.6,118.46 92.3,127.66 111.8,127.66 101.3,117.16 103.7,86.36
  pour Top: -5,69.66 36.6,142.56 123.2,142.56 165.6,69.46 123.5,-3.94 38.8,-3.94
  pour Bottom: 37.6,140.96 122.3,140.86 165.1,69.76 123.5,-3.74 37.5,-4.64 -4.7,69.06
LDO_IN
  Top 1: U2.1 93,37.44 95.84,34.59 | 95.84,34.59 99,31.44 S7.2 98.97,28.84 98.97,26.69 101.5,24.16 TP1.TP | 95.84,34.59 90.3,29.05 90.3,28.87 C5.+
LDO_OUT
  Top 1: L1.1 104.2,34.56 100,34.56 D1.C 99.47,34.56 97.77,34.56 94.75,37.59 94.75,39.46 U2.2
N$1
  Top 0.5: 79.7,80.76 78.82,79.89 78.82,78.31 77.6,77.09 77.6,76.91 DIS3.15 | 79.7,80.76 79.7,82.34 80.4,83.04 80.4,83.74 R2.2 | DIS3.10 90.02,76.91 90.02,77.09 86.52,80.59 79.87,80.59 79.7,80.76
N$2  (via drill 0.25)
  Top 0.5: 95.8,96.51 95.8,95.99 96.67,95.11 96.67,93.54 SP1.1 | 95.8,96.51 TP3.TP | v52.05,50.14 51.35,50.84 51.35,87.64 53.05,89.34 v55.55,89.34 | 95.8,96.51 v88.1,96.51
  Bottom 0.5: v52.05,50.14 53.1,50.14 54.67,51.71 54.67,51.89 U1.15 | v55.55,89.34 63.95,89.34 71.12,96.51 v88.1,96.51
N$3
  Top 0.5: 76.2,59.59 76.2,59.24 75.5,58.54 75.5,57.84 R3.2 | 76.2,59.59 76.2,60.29 74.97,61.51 DIS3.3 | 76.2,59.59 85.65,59.59 87.57,61.51 DIS3.8
N$4
  Bottom 0.5: 79.17,58.89 80.4,57.66 R4.2 | 79.17,58.89 78.47,59.59 74.27,59.59 72.52,61.34 72.52,61.51 DIS3.2 | 79.17,58.89 79.7,59.41 80.4,59.41 82.5,61.51 DIS3.6
N$5
  Top 0.5: DIS3.5 79.87,61.69 79.87,61.86 77.95,63.79 71.82,63.79 71.12,63.09 71.12,62.91 69.9,61.69 DIS3.1
  Bottom 0.5: DIS3.1 69.9,61.51 71.3,60.11 71.3,59.24 70.42,58.36 70.42,57.66 R5.2
N$6
  Bottom 0.5: DIS3.18 69.9,76.74 71.82,74.81 83.2,74.81 83.9,75.51 83.9,75.69 84.95,76.74 DIS3.12 85.12,77.09 85.12,79.21 85.46,79.55 R6.2
N$7  (via drill 0.25)
  Top 0.5: v89.5,91.96 91.07,91.96 100,83.04 100,79.66 104.67,74.99 105.25,74.99 IC1.13
  Bottom 0.5: v89.5,91.96 85.82,95.64 77.77,95.64 76.2,94.06 75.5,94.06 R1.1
N$8
  Top 0.5: IC1.12 105.25,72.36 99.82,77.79 99.82,77.96 98.95,78.84 96.67,78.84 96.5,78.66 94.4,78.66 81.27,91.79 81.27,92.49 80.57,93.19 80.57,93.89 R2.1
N$9
  Bottom 0.5: IC1.11 105.25,69.74 104.02,68.51 98.6,68.51 98.42,68.34 96.5,68.34 96.32,68.51 91.6,63.79 91.6,60.29 87.05,55.74 84.25,55.74 76.2,47.69 75.5,47.69 R3.1
N$10
  Bottom 0.5: IC1.10 105.25,67.11 105.25,66.94 104.2,65.89 101.75,65.89 90.9,55.04 87.05,55.04 81.45,49.44 81.45,49.09 80.57,48.21 80.57,47.69 R4.1
N$11  (via drill 0.25)
  Top 0.5: v92.9,55.39 78.12,55.39 70.6,47.86 70.6,47.51 R5.1
  Bottom 0.5: v92.9,55.39 98.32,55.39 105.25,62.31 105.25,64.66 IC1.9
N$12
  Bottom 0.5: Q2.2 79,103.16 79,102.81 79.17,102.64 79.17,102.11 77.6,100.54 68.67,100.54 65.87,103.34 65.52,103.34 R9.2
N$13
  Top 0.5: U1.26 54.85,80.06 55.02,80.06 57.12,82.16 57.12,107.19 55.2,109.11 55.2,109.46 R8.1
N$14
  Top 0.5: Q1.2 84.6,109.64 84.6,109.99 84.42,110.16 84.42,110.69 84.6,110.86 84.6,111.04 83.37,112.26 68.67,112.26 66.05,109.64 65.35,109.64 R8.2
N$15
  Top 0.5: DIS3.7 85.08,63.86 79.18,69.76 76.01,69.76 72.38,73.39 DIS3.17 72.38,81.26 70.6,83.04 70.6,83.21 R7.2
N$16
  Top 0.5: 39.95,57.66 34.33,57.66 C2.1 | 39.95,57.66 Q3.1 | U1.10 46.94,62.2 42.4,57.66 39.95,57.66
N$17  (via drill 0.25)
  Top 0.5: v64.65,58.16 v64.65,39.64 | v67,67.39 67,104.64 61.5,110.14 61.5,129.94 R10.1
  Bottom 0.5: IC2.15 73.22,37.89 66.4,37.89 v64.65,39.64 | v64.65,58.16 67,60.51 v67,67.39
N$18  (via drill 0.25)
  Top 0.5: v107.52,71.84 107.52,79.49 124.67,96.64 124.67,103.69 121.1,107.26 121.1,112.89 122.92,114.71 R11.1
  Bottom 0.5: IC2.14 73.47,34.84 74.95,33.36 87.77,33.36 91.02,36.61 103.82,36.61 107.52,40.31 v107.52,71.84
N$19
  Bottom 0.5: IC2.13 70.96,35.1 73.8,32.26 122.4,32.26 127.8,37.66 127.8,49.28 133.9,55.38 R12.1
N$20
  Bottom 0.5: IC2.12 68.39,32.8 70.72,30.46 70.72,30.49 76.62,24.59 86.52,24.59 97.54,13.57 R13.1
N$21
  Bottom 0.5: R14.1 35.5,26.21 43.15,33.86 52.75,33.86 56.07,37.19 63.95,37.19 65.7,35.44 65.7,35.26 IC2.11
N$22  (via drill 0.25)
  Top 0.5: IC2.10 63.31,33.07 62.22,31.99 v49.2,31.99 | v42.82,31.49 42.82,32.54 18.27,57.09 18.27,82.86 R15.1
  Bottom 0.5: v49.2,31.99 46.5,31.99 46,31.49 v42.82,31.49
N$23
  Top 0.5: C1.1 39.91,62.35 Q3.2 40.06,62.5 43.59,62.5 43.65,62.54 U1.9
N$24
  Top 0.5: R10.2 72.35,129.94 72.52,130.11 79.17,130.11 79.35,129.94 79.87,129.94 LED1.K
N$25
  Top 0.5: R11.2 128,105.44 132.37,101.06 132.37,99.66 LED2.K
N$26
  Top 0.5: LED3.K 132.44,42.2 R12.2
N$27
  Top 0.5: LED4.K 80.05,8.66 86,8.66 86.17,8.84 87.22,8.84 R13.2
N$28
  Top 0.5: R14.2 30.42,33.15 27.56,36.01 LED5.K
N$29
  Top 0.5: R15.2 23.25,91.76 23.25,95.19 27.55,99.49 LED6.K
N$30
  Top 0.5: IC1.15 104.2,81.11 103.85,81.11 92.12,92.84 86.87,92.84 86.17,93.54 85.47,93.54 R6.1
N$31  (via drill 0.25)
  Top 0.5: v45.75,32.99 45.4,33.34 45.4,58.36 45.92,58.89 46.1,58.89 46.8,59.59 46.97,59.59 U1.11
  Bottom 0.5: v45.75,32.99 47.15,32.99 47.32,33.16 52.67,33.16 70.12,15.71 81.23,15.71 S4.1
N$32
  Bottom 0.5: U1.12 46.97,56.96 39.45,49.44 39.45,44.19 37.87,42.61 37.87,42.09 37,41.21 37,40.86 S5.1
N$33
  Top 0.5: IC1.6 97.72,69.74 96.5,68.51 96.32,68.51 91.6,63.79 91.6,60.29 87.4,56.09 74.45,56.09 70.95,59.59 68.67,59.59 65,63.26 63.25,63.26 60.27,66.24 58.17,66.24 56.42,64.49 56.42,63.79 54.85,62.21 U1.19 54.67,62.04 52.92,60.29 52.92,42.09 51,40.16 51,39.64 ISP1.3
N$35  (via drill 0.25)
  Top 0.5: v47.75,88.41 48.9,87.26 48.9,55.91 47.67,54.69 47.15,54.69 U1.13
  Bottom 0.5: v47.75,88.41 35.75,88.41 33.74,90.43 S6.1
N$37  (via drill 0.25)
  Top 0.5: v58.7,62.56 58,62.56 55.2,59.76 54.85,59.76 U1.18
  Bottom 0.5: v58.7,62.56 66.4,70.26 87.4,70.26 95.8,78.66 96.5,78.66 97.72,79.89 IC1.2 | ISP1.1 53.45,39.64 56.42,42.61 56.42,57.84 54.67,59.59 U1.18
N$38  (via drill 0.25)
  Top 0.5: v71.95,113.64 98.82,113.64 109.89,102.57 109.9,102.58 114.61,97.87 S2.1
  Bottom 0.5: v71.95,113.64 71.95,113.61 51.9,93.56 51.9,90.91 48.52,87.54 47.2,87.54 45.4,85.74 45.4,76.39 46.8,74.99 46.97,74.99 U1.5
N$39  (via drill 0.25)
  Top 0.5: v62.37,65.19 58.17,69.39 58,69.39 55.02,72.36 U1.23
  Bottom 0.5: v62.37,65.19 62.2,65.01 62.2,58.54 74.8,45.94 75.5,45.94 77.25,44.19 77.25,44.01 78.47,42.79 IC2.1
N$40  (via drill 0.25)
  Top 0.5: v73.42,49.04 73.42,47.31 74.8,45.94 74.8,44.01 75.85,42.96 75.85,42.79 IC2.2 | v67.97,62.74 56.95,73.76 55.9,73.76 54.85,74.81 U1.24
  Bottom 0.5: v73.42,49.04 67.97,54.49 v67.97,62.74
N$41  (via drill 0.25)
  Top 0.5: v52.92,82.34 52.92,85.66 54.15,86.89 v55.55,86.89 | v89.15,74.11 90.65,72.61 94.82,72.61 v94.87,72.66
  Bottom 0.5: U1.6 47.5,72.36 52.92,77.79 v52.92,82.34 | v55.55,86.89 57.12,86.89 69.9,74.11 v89.15,74.11 | v94.87,72.66 95.8,73.59 113.42,73.59 126.25,60.76 126.25,46.46 S3.1
N$42  (via drill 0.25)
  Top 0.5: v46.97,35.96 48.37,34.56 54.5,34.56 57.02,37.09 75.75,37.09 82.15,43.49 82.15,50.14 85.65,53.64 93.2,53.64 100.6,61.04 100.6,64.41 97.9,67.11 IC1.7
  Bottom 0.5: v46.97,35.96 46.62,36.31 46.62,45.76 52.92,52.06 52.92,52.76 54.67,54.51 U1.16
N$43  (via drill 0.25)
  Top 0.5: v60.27,65.19 60.27,62.56 55.95,58.24 | 55.95,58.24 54.85,57.14 U1.17 | 55.95,58.24 58.02,56.16 58.02,39.14 54.15,35.26 52.4,35.26 51,36.66 51,36.84 ISP1.4
  Bottom 0.5: v60.27,65.19 66.05,70.96 87.05,70.96 91.6,75.51 91.6,76.39 97.55,82.34 97.72,82.34 IC1.1
N$44
  Top 0.5: U1.27 54.85,82.69 56.42,84.26 56.42,102.11 55.2,103.34 R9.1
N$45  (via drill 0.25)
  Top 0.5: v83.2,90.91 83.2,107.36 82.67,107.89 82.67,108.24 Q1.1
  Bottom 0.5: v83.2,90.91 83.2,78.66 82.5,77.96 82.5,76.91 DIS3.13
N$46  (via drill 0.25)
  Top 0.5: v66.22,60.99 66.22,49.26 69.72,45.76 71.12,45.76 73.4,43.49 73.4,42.79 IC2.3 | v64.82,67.46 54.85,77.44 U1.25
  Bottom 0.5: v66.22,60.99 66.22,66.06 v64.82,67.46
N$47  (via drill 0.25)
  Top 0.5: v77.25,91.26 77.25,101.41 77.07,101.59 77.07,101.94 Q2.1
  Bottom 0.5: v77.25,91.26 77.25,80.41 78.65,79.01 78.65,78.31 79.87,77.09 79.87,76.91 DIS3.14
N$48
  Top 0.5: R1.2 75.46,81.82 74.92,81.48 DIS3.16 74.97,76.74 76.9,74.81 85.65,74.81 87.57,76.74 DIS3.11
N$51  (via drill 0.25)
  Top 0.5: v100.87,82.16 100.87,81.81 105.25,77.44 IC1.14
  Bottom 0.5: v100.87,82.16 91.95,91.09 84.07,91.09 83.02,92.14 72.35,92.14 71.12,93.36 70.6,93.36 R7.1
N$52
  Bottom 0.5: S1.1 76.74,120.82 74.97,119.06 74.97,115.06 52.92,93.01 52.92,83.39 47.15,77.61 U1.4
RESET
  Top 0.5: C9.1 47.85,30.19 47.67,30.19 46.62,31.24 46.62,35.26 46.1,35.79 46.1,37.19 48.37,39.46 ISP1.5 48.55,39.64 48.55,39.81 49.6,40.86 49.6,87.61 48.02,89.19 46.27,89.19 | 46.27,89.19 46.27,86.36 46.97,85.66 46.97,85.14 U1.1 | 46.27,89.19 46.27,102.22 R16.1
RXD  (via drill 0.25)
  Top 0.5: U1.2 47.06,82.56 44.57,82.56 25.45,63.44 25.45,55.17 v25.42,55.15
  Bottom 0.5: v25.42,55.15 25.42,31.8 34.82,22.4 40.6,22.4 41.3,23.1 41.82,23.1 42,22.92 42.52,22.92 JP1.3
TXD
  Top 0.5: U1.3 46.97,79.89 42.95,79.89 26.15,63.09 26.15,57.1 26.67,57.1 35.52,48.25 35.52,45.67 43.92,37.27 43.92,30.97 43.22,30.27 42.52,30.27 40.95,28.7 40.95,27.12 42.52,25.55 JP1.2
VCC
  Top 0.5: JP1.4 42.52,20.3 42,20.3 41.12,19.42 37.54,19.42 TP4.TP

### Text on the board
tNames: ECE 411 - Fall 2020 | Team 15 | Sequence Game | Rev 1.0 11/18/20